# EAGLE design pr0board_key (EAGLE 9.6.2)
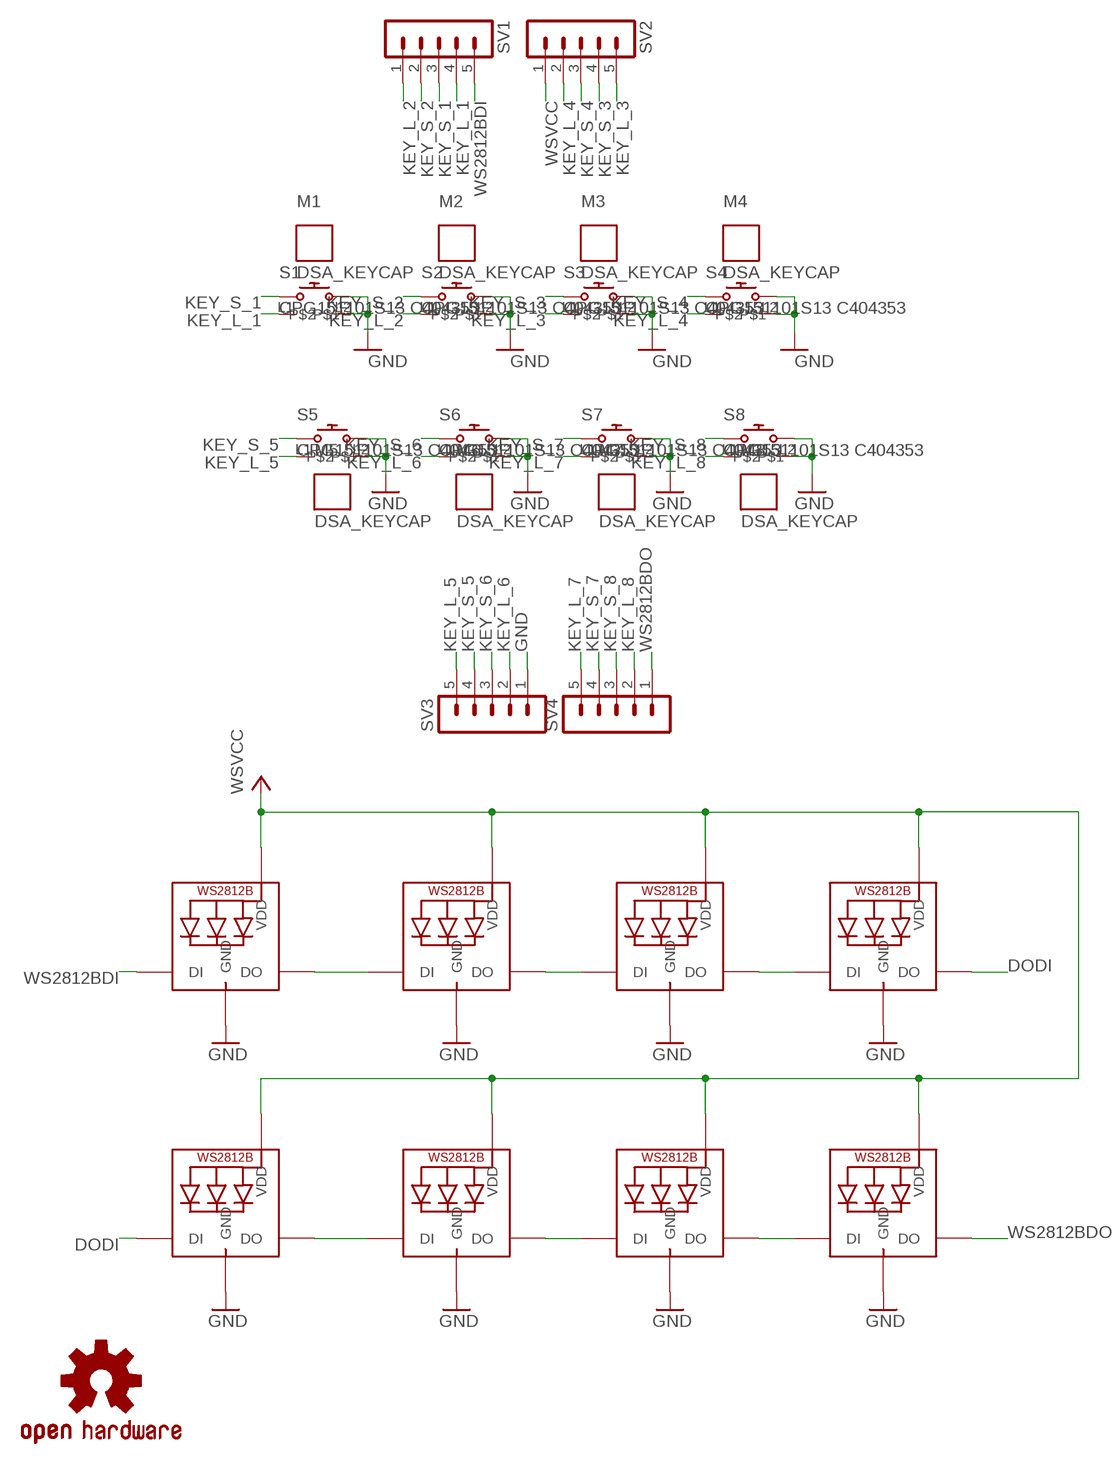
[diagram p0: schematic, sheet 1]

## Parts
LED1  WS2812B3535  [LED3535]
LED2  WS2812B3535  [LED3535]
LED3  WS2812B3535  [LED3535]
LED4  WS2812B3535  [LED3535]
LED5  WS2812B3535  [LED3535]
LED6  WS2812B3535  [LED3535]
LED7  WS2812B3535  [LED3535]
LED8  WS2812B3535  [LED3535]
M1  DSA_KEYCAP  [DSA_KEYCAP]
M2  DSA_KEYCAP  [DSA_KEYCAP]
M3  DSA_KEYCAP  [DSA_KEYCAP]
M4  DSA_KEYCAP  [DSA_KEYCAP]
M5  DSA_KEYCAP  [DSA_KEYCAP]
M6  DSA_KEYCAP  [DSA_KEYCAP]
M7  DSA_KEYCAP  [DSA_KEYCAP]
M8  DSA_KEYCAP  [DSA_KEYCAP]
S1  CPG151101S13 C404353  CHERRY_MX_LED  [CHERRY_MX_LED]
S2  CPG151101S13 C404353  CHERRY_MX_LED  [CHERRY_MX_LED]
S3  CPG151101S13 C404353  CHERRY_MX_LED  [CHERRY_MX_LED]
S4  CPG151101S13 C404353  CHERRY_MX_LED  [CHERRY_MX_LED]
S5  CPG151101S13 C404353  CHERRY_MX_LED  [CHERRY_MX_LED]
S6  CPG151101S13 C404353  CHERRY_MX_LED  [CHERRY_MX_LED]
S7  CPG151101S13 C404353  CHERRY_MX_LED  [CHERRY_MX_LED]
S8  CPG151101S13 C404353  CHERRY_MX_LED  [CHERRY_MX_LED]
SV1  MA05-1  [MA05-1]
SV2  MA05-1  [MA05-1]
SV3  MA05-1  [MA05-1]
SV4  MA05-1  [MA05-1]
U$1  OSHW-LOGOS  [OSHW-LOGO-S]

## Nets
DODI: LED4.2(DO) LED5.4(DI)
GND: LED1.3(GND) LED2.3(GND) LED3.3(GND) LED4.3(GND) LED5.3(GND) LED6.3(GND) LED7.3(GND) LED8.3(GND) S1.L2 S1.S2 S2.L2 S2.S2 S3.L2 S3.S2 S4.L2 S4.S2 S5.L2 S5.S2 S6.L2 S6.S2 S7.L2 S7.S2 S8.L2 S8.S2 SV3.1
KEY_L_1: S1.L1 SV1.4
KEY_L_2: S2.L1 SV1.1
KEY_L_3: S3.L1 SV2.5
KEY_L_4: S4.L1 SV2.2
KEY_L_5: S5.L1 SV3.5
KEY_L_6: S6.L1 SV3.2
KEY_L_7: S7.L1 SV4.5
KEY_L_8: S8.L1 SV4.2
KEY_S_1: S1.S1 SV1.3
KEY_S_2: S2.S1 SV1.2
KEY_S_3: S3.S1 SV2.4
KEY_S_4: S4.S1 SV2.3
KEY_S_5: S5.S1 SV3.4
KEY_S_6: S6.S1 SV3.3
KEY_S_7: S7.S1 SV4.4
KEY_S_8: S8.S1 SV4.3
N$8: LED1.2(DO) LED2.4(DI)
N$9: LED2.2(DO) LED3.4(DI)
N$10: LED3.2(DO) LED4.4(DI)
N$13: LED5.2(DO) LED6.4(DI)
N$14: LED6.2(DO) LED7.4(DI)
N$15: LED7.2(DO) LED8.4(DI)
WS2812BDI: LED1.4(DI) SV1.5
WS2812BDO: LED8.2(DO) SV4.1
WSVCC: LED1.1(VDD) LED2.1(VDD) LED3.1(VDD) LED4.1(VDD) LED5.1(VDD) LED6.1(VDD) LED7.1(VDD) LED8.1(VDD) SV2.1

## Library data of the parts
LED1-LED8 = adafruit:WS2812B
M1-M8 = cherry:DSA_KEYCAP: DSA keycap
S1-S8 = cherry:CHERRY_MX_LED: Cherry MX with LED; FARNELL: 2292961; MOUSER: 540_MX1A_11NW
SV1-SV4 = con-lstb:MA05-1: PIN HEADER; OC_FARNELL: unknown; OC_NEWARK: unknown
U$1 = SparkFun:OSHW-LOGO: Open Source Hardware Logo This logo indicates the piece of hardware it is found on incorporates a OSHW license and/or adheres to the definition of open source hardware found here: http://freedomdefined.org/OSHW

## Board
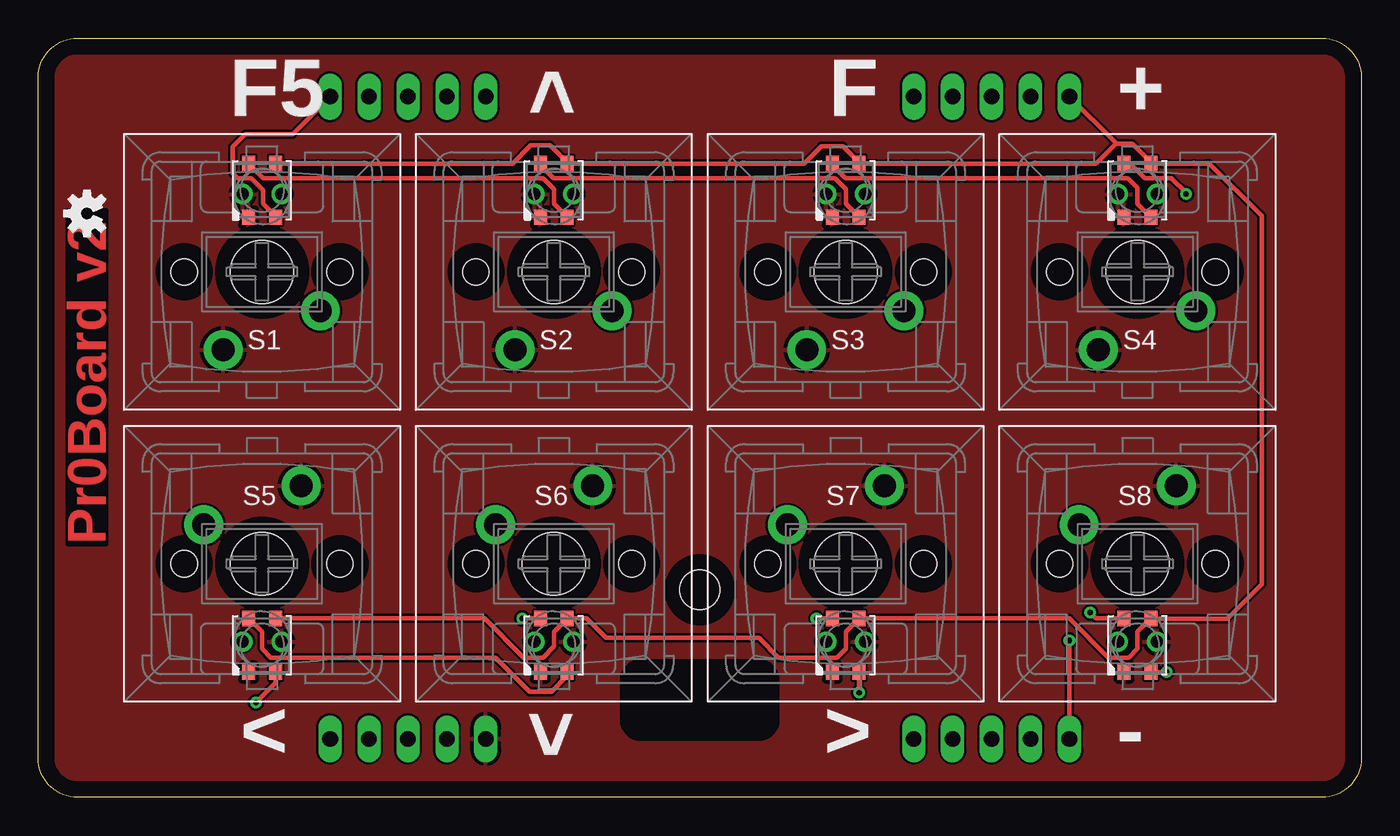
[diagram p1: board, top side]
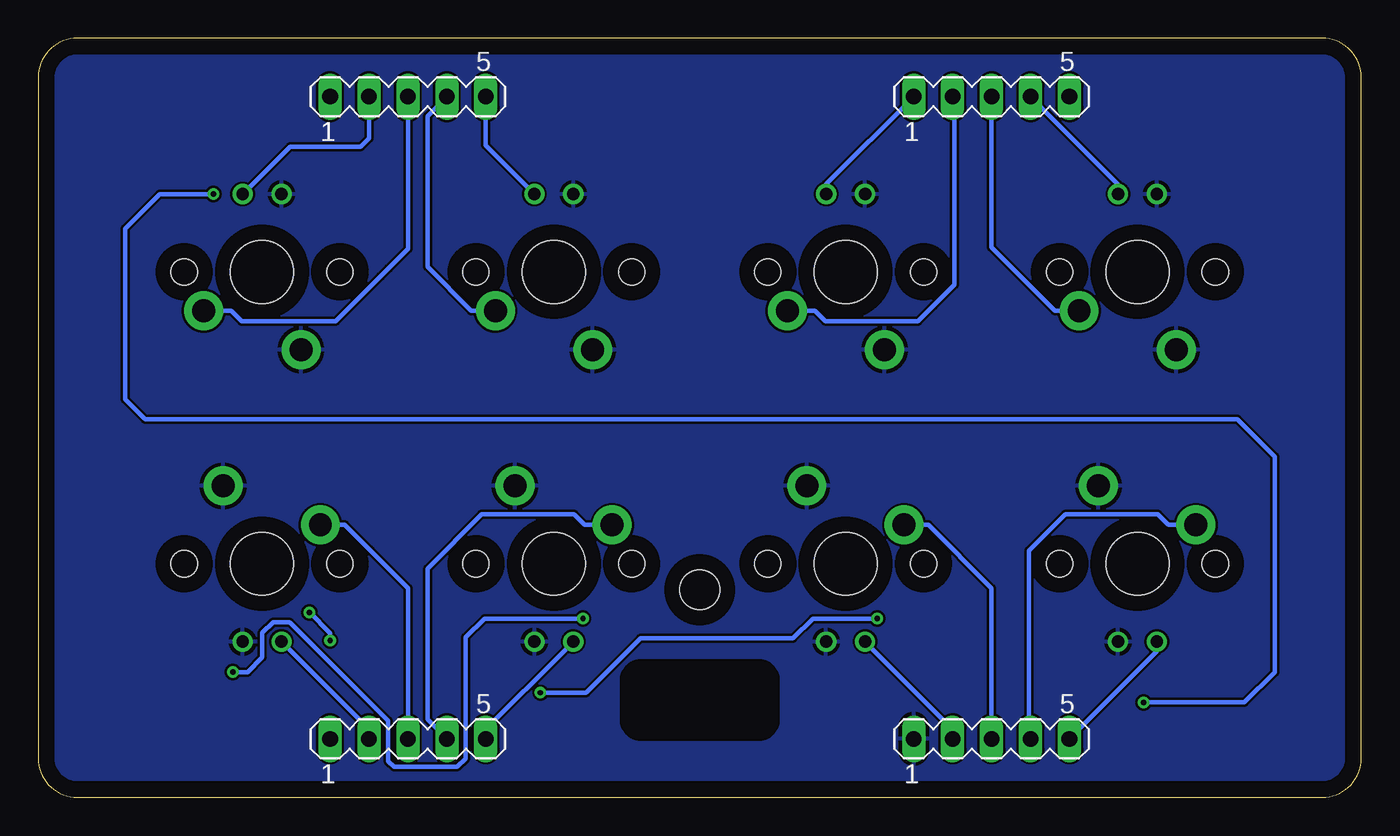
[diagram p2: board, bottom side, seen from below]

Size 86.36 x 49.53 mm. Coordinates in mm from the lower left corner, seen from the top.
Outline: 0,2.54 0,46.99 arc-90 2.54,49.53 83.82,49.53 arc-90 86.36,46.99 86.36,2.54 arc-90 83.82,0 2.54,0 arc-90 0,2.54
Copper layers (1*16): Top 0.035mm / dielectric 1.5mm / Bottom 0.035mm
Design rules "default": minimum track width 6mil, minimum drill 0.35mm, track to track 6mil, track to pad 6mil, pad to pad 6mil, via to via 6mil, smd to smd 6mil, copper to edge 40mil, drill to drill 6mil, minimum pad ring 10mil, minimum via ring 8mil, stop-mask expansion 4mil, vias tented up to drill 0mil, thermal gap 10mil
Holes 2.6 mm at 43.18,13.54
tRestrict: area 38.1,3.8 to 48.3,8.9
bRestrict: area 38.1,3.8 to 48.3,8.9

### Footprints (pad centres in the part's own frame; a part is rotated, then mirrored left to right if it is on the bottom)
LED3535 = smd 1 x 0.85: 1 -1.75,0.875; 2 -1.75,-0.875; 3 1.75,-0.875; 4 1.75,0.875
CHERRY_MX_LED = drill 0.8: L1 -1.27,-5.08; L2 1.27,-5.08 | drill 1.5 pad 2.54: S1 -3.81,2.54; S2 2.54,5.08 | hole 1.7: -5.08,0; 5.08,0 | hole 4.1: 0,0
MA05-1 = drill 1.016 long: 1 -5.08,0; 2 -2.54,0; 3 0,0; 4 2.54,0; 5 5.08,0

### Placement (x,y rotation side)
LED1  14.61,39.61 270 top
LED2  33.66,39.61 270 top
LED3  52.7,39.61 270 top
LED4  71.75,39.61 270 top
LED5  14.61,9.92 270 top
LED6  33.66,9.92 270 top
LED7  52.7,9.92 270 top
LED8  71.75,9.92 270 top
M1  14.61,34.29 180 top
M2  33.66,34.29 180 top
M3  52.7,34.29 180 top
M4  71.75,34.29 180 top
M5  14.61,15.24 0 top
M6  33.66,15.24 0 top
M7  52.7,15.24 0 top
M8  71.75,15.24 0 top
S1  14.61,34.29 180 top
S2  33.66,34.29 180 top
S3  52.7,34.29 180 top
S4  71.75,34.29 180 top
S5  14.61,15.24 0 top
S6  33.66,15.24 0 top
S7  52.7,15.24 0 top
S8  71.75,15.24 0 top
SV1  24.13,45.72 0 bottom
SV2  62.23,45.72 0 bottom
SV3  24.13,3.81 0 bottom
SV4  62.23,3.81 0 bottom
U$1  3.17,38.1 90 top

### Tracks (layer width: path | path; a pad name or v marks a point on that pad's centre or on a via)
DODI  (via drill 0.35)
  Top 0.305: LED4.2 71.27,41.36 72.08,40.55 72.23,40.4 73.98,40.4 74.93,39.45 v74.93,39.37 | v14.21,6.19 15.48,7.46 LED5.4
  Bottom 0.305: v74.93,39.37 78.42,39.37 80.68,37.11 80.68,25.99 79.38,24.69 8.1,24.69 5.64,22.23 5.64,8.18 7.62,6.19 v14.21,6.19
GND
  pour Bottom: -0.16,-0.87 -0.16,50.8 86.68,50.8 86.68,-0.87
  pour Top: 0,-1.03 0,49.85 87.71,49.85 87.71,-1.03
KEY_L_1
  Bottom 0.305: SV1.4 15.88,40.01 S1.L1
KEY_L_2
  Bottom 0.305: SV1.1 34.92,40.01 S2.L1
KEY_L_3
  Bottom 0.305: S3.L1 57.15,42.55 SV2.5
KEY_L_4
  Bottom 0.305: SV2.2 64.77,43.02 65.33,42.47 69.93,42.47 S4.L1
KEY_L_5
  Bottom 0.305: SV3.5 13.34,9.53 S5.L1
KEY_L_6
  Bottom 0.305: SV3.2 26.67,4.45 S6.L1
KEY_L_7
  Bottom 0.305: SV4.5 57.78,3.81 S7.L1
KEY_L_8
  Bottom 0.305: SV4.2 64.77,4.45 S8.L1
KEY_S_1
  Bottom 0.305: SV1.3 24.13,35.88 20,31.75 S1.S1
KEY_S_2
  Bottom 0.305: SV1.2 26.56,45.61 26.56,33.45 27.94,32.07 28.94,31.07 34.99,31.07 35.67,31.75 S2.S1
KEY_S_3
  Bottom 0.305: S3.S1 58.1,31.75 60.96,34.61 60.96,44.45 SV2.4
KEY_S_4
  Bottom 0.305: S4.S1 73.77,31.75 73.09,31.07 66.96,31.07 64.02,34.01 63.5,34.53 62.23,35.8 SV2.3
KEY_S_5
  Bottom 0.305: SV3.4 21.7,3.92 21.7,16.08 20.72,17.06 20.72,17.07 19.32,18.46 13.27,18.46 12.59,17.78 S5.S1
KEY_S_6
  Bottom 0.305: SV3.3 24.13,13.65 28.26,17.78 S6.S1
KEY_S_7
  Bottom 0.305: S7.S1 50.69,17.78 51.37,18.46 57.42,18.46 60.96,14.92 60.96,5.08 SV4.4
KEY_S_8
  Bottom 0.305: S8.S1 66.36,17.78 64.77,16.19 64.66,16.08 62.23,13.65 SV4.3
N$8
  Top 0.305: LED1.2 14.68,40.41 32.94,40.41 33.66,39.69 33.66,38.73 LED2.4
N$9
  Top 0.305: LED3.4 52.71,38.73 52.71,39.69 51.99,40.41 33.65,40.41 32.78,41.28 LED2.2
N$10
  Top 0.305: LED4.4 71.76,38.73 71.76,39.77 71.12,40.41 52.7,40.41 51.83,41.28 LED3.2
N$13
  Top 0.305: LED5.2 14.6,10.8 14.6,9.68 15.16,9.12 29.84,9.12 32.07,6.89 33.49,6.89 34.53,7.93 LED6.4
N$14  (via drill 0.35)
  Top 0.305: LED6.2 v31.59,11.67 | v53.58,6.83 LED7.4
  Bottom 0.305: v53.58,6.83 v53.57,6.82 50.62,6.82 47.05,10.38 37.08,10.38 35.8,11.67 v31.59,11.67
N$15  (via drill 0.35)
  Top 0.305: LED7.2 v50.8,11.67 | v73.66,8.18 v73.66,8.17 LED8.4
  Bottom 0.305: v73.66,8.18 v73.65,8.17 72.71,8.17 71.75,9.13 71.75,10.73 71.04,11.44 69.97,11.44 63.53,5 63.53,2.37 63.15,1.98 59.01,1.98 58.46,2.53 58.46,10.44 57.24,11.67 v50.8,11.67
WS2812BDI
  Top 0.305: SV1.5 16.6,43.27 13.5,43.27 12.68,42.46 12.68,40.73 13.02,40.4 13.9,40.4 14.68,39.62 14.68,38.73 15.48,37.93 LED1.4
WS2812BDO  (via drill 0.35)
  Top 0.305: LED8.2 69.05,11.67 v68.66,12.06 | v67.31,10.24 SV4.1
  Bottom 0.305: v68.66,12.06 67.31,10.72 v67.31,10.24
WSVCC
  Top 0.305: LED1.1 30.95,41.36 32.15,42.56 33.41,42.56 34.53,41.44 LED2.1 50,41.36 51.12,42.48 52.54,42.48 53.58,41.44 LED3.1 69.05,41.36 70.33,42.64 | 70.33,42.64 71.43,42.64 72.63,41.44 LED4.1 76.43,41.36 79.86,37.94 79.86,13.9 77.63,11.67 LED8.1 71.76,10.8 71.76,9.68 71.2,9.12 69.85,9.12 67.3,11.67 LED7.1 52.71,10.8 52.71,9.68 52.15,9.12 48.32,9.12 47.04,10.4 37.07,10.4 35.8,11.67 LED6.1 33.66,10.8 33.66,9.84 32.94,9.12 31.67,9.12 29.12,11.67 LED5.1 | SV2.1 70.33,42.7 70.33,42.64

### Text on the board
Top: Pr0Board v2
tNames: F5 | > | F | + | < | < | > | -
tStop: Pr0Board v2